# Altium schematic sheet MAT_CABLING_CONNECTOR.SchDoc: =DocumentName
size B; SheetNumber: 7; SheetTotal: 8
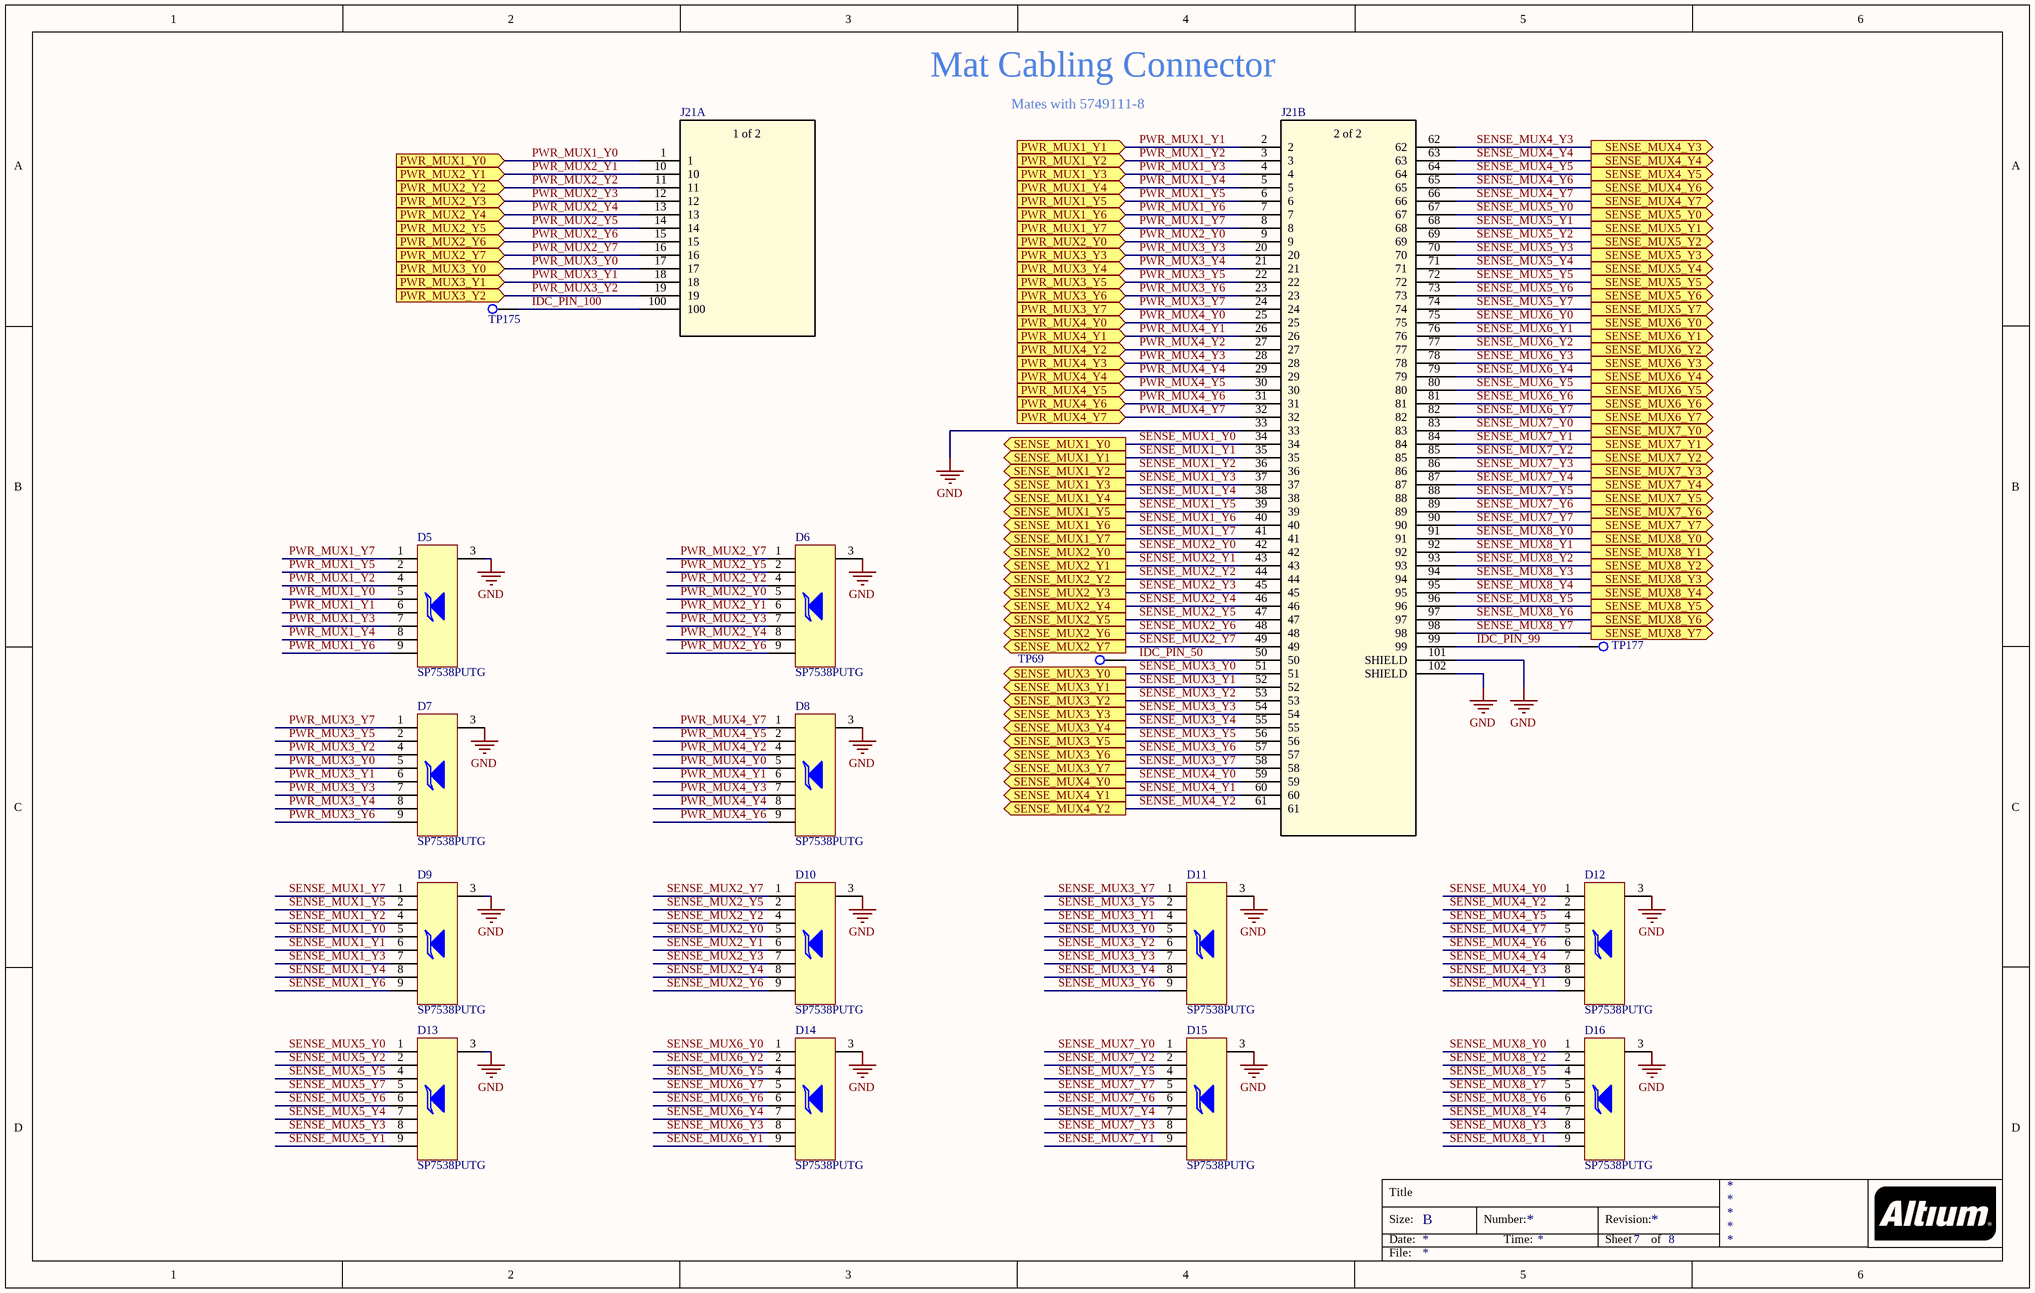
[diagram p0: MAT_CABLING_CONNECTOR.SchDoc]

## Parts
D5  SP7538PUTG  [SP7538PUTG]
D6  SP7538PUTG  [SP7538PUTG]
D7  SP7538PUTG  [SP7538PUTG]
D8  SP7538PUTG  [SP7538PUTG]
D9  SP7538PUTG  [SP7538PUTG]
D10  SP7538PUTG  [SP7538PUTG]
D11  SP7538PUTG  [SP7538PUTG]
D12  SP7538PUTG  [SP7538PUTG]
D13  SP7538PUTG  [SP7538PUTG]
D14  SP7538PUTG  [SP7538PUTG]
D15  SP7538PUTG  [SP7538PUTG]
D16  SP7538PUTG  [SP7538PUTG]
J21  1-787082-8  [CONN100_1-787082-8_TEC]  (value not drawn)  (parts A,B of 2)
TP69  RCU-0C  [TP+195X110]  (value not drawn)
TP175  RCU-0C  [TP+195X110]  (value not drawn)
TP177  RCU-0C  [TP+195X110]  (value not drawn)

## Ports
PWR_MUX1_Y0 (in), PWR_MUX1_Y1 (in), PWR_MUX1_Y2 (in), PWR_MUX1_Y3 (in), PWR_MUX1_Y4 (in), PWR_MUX1_Y5 (in), PWR_MUX1_Y6 (in), PWR_MUX1_Y7 (in), PWR_MUX2_Y0 (in), PWR_MUX2_Y1 (in), PWR_MUX2_Y2 (in), PWR_MUX2_Y3 (in), PWR_MUX2_Y4 (in), PWR_MUX2_Y5 (in), PWR_MUX2_Y6 (in), PWR_MUX2_Y7 (in), PWR_MUX3_Y0 (in), PWR_MUX3_Y1 (in), PWR_MUX3_Y2 (in), PWR_MUX3_Y3 (in), PWR_MUX3_Y4 (in), PWR_MUX3_Y5 (in), PWR_MUX3_Y6 (in), PWR_MUX3_Y7 (in), PWR_MUX4_Y0 (in), PWR_MUX4_Y1 (in), PWR_MUX4_Y2 (in), PWR_MUX4_Y3 (in), PWR_MUX4_Y4 (in), PWR_MUX4_Y5 (in), PWR_MUX4_Y6 (in), PWR_MUX4_Y7 (in), SENSE_MUX1_Y0 (out), SENSE_MUX1_Y1 (out), SENSE_MUX1_Y2 (out), SENSE_MUX1_Y3 (out), SENSE_MUX1_Y4 (out), SENSE_MUX1_Y5 (out), SENSE_MUX1_Y6 (out), SENSE_MUX1_Y7 (out), SENSE_MUX2_Y0 (out), SENSE_MUX2_Y1 (out), SENSE_MUX2_Y2 (out), SENSE_MUX2_Y3 (out), SENSE_MUX2_Y4 (out), SENSE_MUX2_Y5 (out), SENSE_MUX2_Y6 (out), SENSE_MUX2_Y7 (out), SENSE_MUX3_Y0 (out), SENSE_MUX3_Y1 (out), SENSE_MUX3_Y2 (out), SENSE_MUX3_Y3 (out), SENSE_MUX3_Y4 (out), SENSE_MUX3_Y5 (out), SENSE_MUX3_Y6 (out), SENSE_MUX3_Y7 (out), SENSE_MUX4_Y0 (out), SENSE_MUX4_Y1 (out), SENSE_MUX4_Y2 (out), SENSE_MUX4_Y3 (out), SENSE_MUX4_Y4 (out), SENSE_MUX4_Y5 (out), SENSE_MUX4_Y6 (out), SENSE_MUX4_Y7 (out), SENSE_MUX5_Y0 (out), SENSE_MUX5_Y1 (out), SENSE_MUX5_Y2 (out), SENSE_MUX5_Y3 (out), SENSE_MUX5_Y4 (out), SENSE_MUX5_Y5 (out), SENSE_MUX5_Y6 (out), SENSE_MUX5_Y7 (out), SENSE_MUX6_Y0 (out), SENSE_MUX6_Y1 (out), SENSE_MUX6_Y2 (out), SENSE_MUX6_Y3 (out), SENSE_MUX6_Y4 (out), SENSE_MUX6_Y5 (out), SENSE_MUX6_Y6 (out), SENSE_MUX6_Y7 (out), SENSE_MUX7_Y0 (out), SENSE_MUX7_Y1 (out), SENSE_MUX7_Y2 (out), SENSE_MUX7_Y3 (out), SENSE_MUX7_Y4 (out), SENSE_MUX7_Y5 (out), SENSE_MUX7_Y6 (out), SENSE_MUX7_Y7 (out), SENSE_MUX8_Y0 (out), SENSE_MUX8_Y1 (out), SENSE_MUX8_Y2 (out), SENSE_MUX8_Y3 (out), SENSE_MUX8_Y4 (out), SENSE_MUX8_Y5 (out), SENSE_MUX8_Y6 (out), SENSE_MUX8_Y7 (out)

## Nets
GND: D5.3 D6.3 D7.3 D8.3 D9.3 D10.3 D11.3 D12.3 D13.3 D14.3 D15.3 D16.3 J21.33 J21.101(SHIELD) J21.102(SHIELD)
IDC_PIN_50: J21.50 TP69.1
IDC_PIN_99: J21.99 TP177.1
IDC_PIN_100: J21.100 TP175.1
PWR_MUX1_Y0: D5.5 J21.1 ; port PWR_MUX1_Y0
PWR_MUX1_Y1: D5.6 J21.2 ; port PWR_MUX1_Y1
PWR_MUX1_Y2: D5.4 J21.3 ; port PWR_MUX1_Y2
PWR_MUX1_Y3: D5.7 J21.4 ; port PWR_MUX1_Y3
PWR_MUX1_Y4: D5.8 J21.5 ; port PWR_MUX1_Y4
PWR_MUX1_Y5: D5.2 J21.6 ; port PWR_MUX1_Y5
PWR_MUX1_Y6: D5.9 J21.7 ; port PWR_MUX1_Y6
PWR_MUX1_Y7: D5.1 J21.8 ; port PWR_MUX1_Y7
PWR_MUX2_Y0: D6.5 J21.9 ; port PWR_MUX2_Y0
PWR_MUX2_Y1: D6.6 J21.10 ; port PWR_MUX2_Y1
PWR_MUX2_Y2: D6.4 J21.11 ; port PWR_MUX2_Y2
PWR_MUX2_Y3: D6.7 J21.12 ; port PWR_MUX2_Y3
PWR_MUX2_Y4: D6.8 J21.13 ; port PWR_MUX2_Y4
PWR_MUX2_Y5: D6.2 J21.14 ; port PWR_MUX2_Y5
PWR_MUX2_Y6: D6.9 J21.15 ; port PWR_MUX2_Y6
PWR_MUX2_Y7: D6.1 J21.16 ; port PWR_MUX2_Y7
PWR_MUX3_Y0: D7.5 J21.17 ; port PWR_MUX3_Y0
PWR_MUX3_Y1: D7.6 J21.18 ; port PWR_MUX3_Y1
PWR_MUX3_Y2: D7.4 J21.19 ; port PWR_MUX3_Y2
PWR_MUX3_Y3: D7.7 J21.20 ; port PWR_MUX3_Y3
PWR_MUX3_Y4: D7.8 J21.21 ; port PWR_MUX3_Y4
PWR_MUX3_Y5: D7.2 J21.22 ; port PWR_MUX3_Y5
PWR_MUX3_Y6: D7.9 J21.23 ; port PWR_MUX3_Y6
PWR_MUX3_Y7: D7.1 J21.24 ; port PWR_MUX3_Y7
PWR_MUX4_Y0: D8.5 J21.25 ; port PWR_MUX4_Y0
PWR_MUX4_Y1: D8.6 J21.26 ; port PWR_MUX4_Y1
PWR_MUX4_Y2: D8.4 J21.27 ; port PWR_MUX4_Y2
PWR_MUX4_Y3: D8.7 J21.28 ; port PWR_MUX4_Y3
PWR_MUX4_Y4: D8.8 J21.29 ; port PWR_MUX4_Y4
PWR_MUX4_Y5: D8.2 J21.30 ; port PWR_MUX4_Y5
PWR_MUX4_Y6: D8.9 J21.31 ; port PWR_MUX4_Y6
PWR_MUX4_Y7: D8.1 J21.32 ; port PWR_MUX4_Y7
SENSE_MUX1_Y0: D9.5 J21.34 ; port SENSE_MUX1_Y0
SENSE_MUX1_Y1: D9.6 J21.35 ; port SENSE_MUX1_Y1
SENSE_MUX1_Y2: D9.4 J21.36 ; port SENSE_MUX1_Y2
SENSE_MUX1_Y3: D9.7 J21.37 ; port SENSE_MUX1_Y3
SENSE_MUX1_Y4: D9.8 J21.38 ; port SENSE_MUX1_Y4
SENSE_MUX1_Y5: D9.2 J21.39 ; port SENSE_MUX1_Y5
SENSE_MUX1_Y6: D9.9 J21.40 ; port SENSE_MUX1_Y6
SENSE_MUX1_Y7: D9.1 J21.41 ; port SENSE_MUX1_Y7
SENSE_MUX2_Y0: D10.5 J21.42 ; port SENSE_MUX2_Y0
SENSE_MUX2_Y1: D10.6 J21.43 ; port SENSE_MUX2_Y1
SENSE_MUX2_Y2: D10.4 J21.44 ; port SENSE_MUX2_Y2
SENSE_MUX2_Y3: D10.7 J21.45 ; port SENSE_MUX2_Y3
SENSE_MUX2_Y4: D10.8 J21.46 ; port SENSE_MUX2_Y4
SENSE_MUX2_Y5: D10.2 J21.47 ; port SENSE_MUX2_Y5
SENSE_MUX2_Y6: D10.9 J21.48 ; port SENSE_MUX2_Y6
SENSE_MUX2_Y7: D10.1 J21.49 ; port SENSE_MUX2_Y7
SENSE_MUX3_Y0: D11.5 J21.51 ; port SENSE_MUX3_Y0
SENSE_MUX3_Y1: D11.4 J21.52 ; port SENSE_MUX3_Y1
SENSE_MUX3_Y2: D11.6 J21.53 ; port SENSE_MUX3_Y2
SENSE_MUX3_Y3: D11.7 J21.54 ; port SENSE_MUX3_Y3
SENSE_MUX3_Y4: D11.8 J21.55 ; port SENSE_MUX3_Y4
SENSE_MUX3_Y5: D11.2 J21.56 ; port SENSE_MUX3_Y5
SENSE_MUX3_Y6: D11.9 J21.57 ; port SENSE_MUX3_Y6
SENSE_MUX3_Y7: D11.1 J21.58 ; port SENSE_MUX3_Y7
SENSE_MUX4_Y0: D12.1 J21.59 ; port SENSE_MUX4_Y0
SENSE_MUX4_Y1: D12.9 J21.60 ; port SENSE_MUX4_Y1
SENSE_MUX4_Y2: D12.2 J21.61 ; port SENSE_MUX4_Y2
SENSE_MUX4_Y3: D12.8 J21.62 ; port SENSE_MUX4_Y3
SENSE_MUX4_Y4: D12.7 J21.63 ; port SENSE_MUX4_Y4
SENSE_MUX4_Y5: D12.4 J21.64 ; port SENSE_MUX4_Y5
SENSE_MUX4_Y6: D12.6 J21.65 ; port SENSE_MUX4_Y6
SENSE_MUX4_Y7: D12.5 J21.66 ; port SENSE_MUX4_Y7
SENSE_MUX5_Y0: D13.1 J21.67 ; port SENSE_MUX5_Y0
SENSE_MUX5_Y1: D13.9 J21.68 ; port SENSE_MUX5_Y1
SENSE_MUX5_Y2: D13.2 J21.69 ; port SENSE_MUX5_Y2
SENSE_MUX5_Y3: D13.8 J21.70 ; port SENSE_MUX5_Y3
SENSE_MUX5_Y4: D13.7 J21.71 ; port SENSE_MUX5_Y4
SENSE_MUX5_Y5: D13.4 J21.72 ; port SENSE_MUX5_Y5
SENSE_MUX5_Y6: D13.6 J21.73 ; port SENSE_MUX5_Y6
SENSE_MUX5_Y7: D13.5 J21.74 ; port SENSE_MUX5_Y7
SENSE_MUX6_Y0: D14.1 J21.75 ; port SENSE_MUX6_Y0
SENSE_MUX6_Y1: D14.9 J21.76 ; port SENSE_MUX6_Y1
SENSE_MUX6_Y2: D14.2 J21.77 ; port SENSE_MUX6_Y2
SENSE_MUX6_Y3: D14.8 J21.78 ; port SENSE_MUX6_Y3
SENSE_MUX6_Y4: D14.7 J21.79 ; port SENSE_MUX6_Y4
SENSE_MUX6_Y5: D14.4 J21.80 ; port SENSE_MUX6_Y5
SENSE_MUX6_Y6: D14.6 J21.81 ; port SENSE_MUX6_Y6
SENSE_MUX6_Y7: D14.5 J21.82 ; port SENSE_MUX6_Y7
SENSE_MUX7_Y0: D15.1 J21.83 ; port SENSE_MUX7_Y0
SENSE_MUX7_Y1: D15.9 J21.84 ; port SENSE_MUX7_Y1
SENSE_MUX7_Y2: D15.2 J21.85 ; port SENSE_MUX7_Y2
SENSE_MUX7_Y3: D15.8 J21.86 ; port SENSE_MUX7_Y3
SENSE_MUX7_Y4: D15.7 J21.87 ; port SENSE_MUX7_Y4
SENSE_MUX7_Y5: D15.4 J21.88 ; port SENSE_MUX7_Y5
SENSE_MUX7_Y6: D15.6 J21.89 ; port SENSE_MUX7_Y6
SENSE_MUX7_Y7: D15.5 J21.90 ; port SENSE_MUX7_Y7
SENSE_MUX8_Y0: D16.1 J21.91 ; port SENSE_MUX8_Y0
SENSE_MUX8_Y1: D16.9 J21.92 ; port SENSE_MUX8_Y1
SENSE_MUX8_Y2: D16.2 J21.93 ; port SENSE_MUX8_Y2
SENSE_MUX8_Y3: D16.8 J21.94 ; port SENSE_MUX8_Y3
SENSE_MUX8_Y4: D16.7 J21.95 ; port SENSE_MUX8_Y4
SENSE_MUX8_Y5: D16.4 J21.96 ; port SENSE_MUX8_Y5
SENSE_MUX8_Y6: D16.6 J21.97 ; port SENSE_MUX8_Y6
SENSE_MUX8_Y7: D16.5 J21.98 ; port SENSE_MUX8_Y7

## Notes on the sheet
- Mat Cabling Connector
- Mates with 5749111-8
- Title
- Size:
- Date:
- B
- Number:
- Time:
- Revision:
- Sheet
- of
- File:
- (in symbol 1-787082-8, part A) 1 of 2
- (in symbol 1-787082-8, part B) 2 of 2

## Library data of the parts
D5-D16 = SP7538PUTG: ESD Suppressor TVS Octal Uni-Dir 25kV 9-Pin UDFN T/R; Manufacturer: Littelfuse; Number of Unidirectional Channels: 8; Reverse Standoff Voltage: 5V; Clamping Voltage: 7V; Peak Pulse Current: 2A; Power Line Protection: Yes; Supplier: Digi-Key; RoHS: Yes; Category: TVS Diodes; Stock 1: 40273; Pricing 1: 1=0.95000, 10=0.85200, 100=0.66410, 500=0.54862, 1000=0.43838 (USD); Mount: Surface Mount; Number of Pins: 9; Min Operating Temperature: -40°C; Max Operating Temperature: 150°C; Packaging: Cut Tape; RoHS Compliant: Yes; ComponentLink1URL: http://www.littelfuse.com/~/media/electronics/datasheets/tvs_diode_arrays/littelfuse_tvs_diode_array_sp7538p_datasheet.pdf.pdf?src-supplier=Farnell; ComponentLink1Description: http://www.littelfuse.com/~/media/electronics/datasheets/tvs_diode_arrays/littelfuse_tvs_diode_array_sp7538p_datasheet.pdf.pdf?src-supplier=Farnell; ComponentLink2URL: http://www.littelfuse.com/~/media/electronics/datasheets/tvs_diode_arrays/littelfuse_tvs_diode_array_sp7538p_datasheet.pdf.pdf?src-supplier=Digi-Key; ComponentLink2Description: http://www.littelfuse.com/~/media/electronics/datasheets/tvs_diode_arrays/littelfuse_tvs_diode_array_sp7538p_datasheet.pdf.pdf?src-supplier=Digi-Key; ComponentLink3URL: https://www.littelfuse.com/~/media/electronics/datasheets/tvs_diode_arrays/littelfuse_tvs_diode_array_sp7538p_datasheet.pdf.pdf?src-supplier=Digi-Key; ComponentLink3Description: https://www.littelfuse.com/~/media/electronics/datasheets/tvs_diode_arrays/littelfuse_tvs_diode_array_sp7538p_datasheet.pdf.pdf?src-supplier=Digi-Key; ComponentLink4URL: http://www.littelfuse.com/~/media/electronics/datasheets/tvs_diode_arrays/littelfuse_tvs_diode_array_sp7538p_datasheet.pdf.pdf?src-supplier=Arrow+Electronics; ComponentLink4Description: http://www.littelfuse.com/~/media/electronics/datasheets/tvs_diode_arrays/littelfuse_tvs_diode_array_sp7538p_datasheet.pdf.pdf?src-supplier=Arrow+Electronics; ComponentLink5URL: http://www.littelfuse.com/~/media/electronics/datasheets/tvs_diode_arrays/littelfuse_tvs_diode_array_sp7538p_datasheet.pdf.pdf?src-supplier=Mouser; ComponentLink5Description: http://www.littelfuse.com/~/media/electronics/datasheets/tvs_diode_arrays/littelfuse_tvs_diode_array_sp7538p_datasheet.pdf.pdf?src-supplier=Mouser; ComponentLink6URL: http://www.littelfuse.com/~/media/electronics/datasheets/tvs_diode_arrays/littelfuse_tvs_diode_array_sp7538p_datasheet.pdf.pdf?src-supplier=Verical; ComponentLink6Description: http://www.littelfuse.com/~/media/electronics/datasheets/tvs_diode_arrays/littelfuse_tvs_diode_array_sp7538p_datasheet.pdf.pdf?src-supplier=Verical; ComponentLink7URL: http://www.littelfuse.com/~/media/electronics/datasheets/tvs_diode_arrays/littelfuse_tvs_diode_array_sp7538p_datasheet.pdf.pdf?src-supplier=Newark; ComponentLink7Description: http://www.littelfuse.com/~/media/electronics/datasheets/tvs_diode_arrays/littelfuse_tvs_diode_array_sp7538p_datasheet.pdf.pdf?src-supplier=Newark; ComponentLink8URL: http://www.littelfuse.com/~/media/electronics/datasheets/tvs_diode_arrays/littelfuse_tvs_diode_array_sp7538p_datasheet.pdf.pdf?src-supplier=TTI; ComponentLink8Description: http://www.littelfuse.com/~/media/electronics/datasheets/tvs_diode_arrays/littelfuse_tvs_diode_array_sp7538p_datasheet.pdf.pdf?src-supplier=TTI; Supplier Part Number: F7417CT-ND; Manufacturer Part Number: SP7538PUTG
J21 = 1-787082-8: No Description Available; Mfr_Name: TE Connectivity; Copyright: Copyright (C) 2022 Ultra Librarian. All rights reserved.; Manufacturer_Part_Number: 1-787082-8; Digi-Key_Part_Number_1: A35091-ND; RefDes: RefDes; Type: DEV
TP69 TP175 TP177 = RCU-0C: Natural PC Test Point , Plating Surface Mount Mounting Type; Manufacturer: TE Connectivity AMP Connectors; Value: *; Package: SON-6 TE Connectivity AMP Connectors; Purchase-URL: https://pricing.snapeda.com/search/part/RCU-0C/?ref=eda; Supplier Part Number: A106145CT-ND; Check_prices: https://www.snapeda.com/parts/RCU-0C/TE%20Connectivity/view-part/4791537/?ref=eda; Manufacturer Part Number: RCU-0C; SnapEDA_Link: https://www.snapeda.com/parts/RCU-0C/TE%20Connectivity/view-part/4791537/?ref=snap; Supplier: Digi-Key